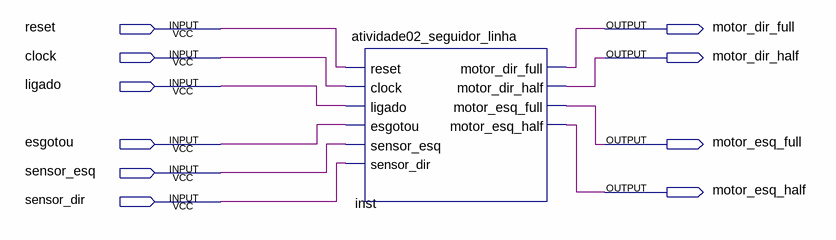
[diagram p0: schematic sheet]
// Quartus schematic Block1.bdf as structural Verilog: 1 symbols, 10 pins
module Block1 (
  input  reset,
  input  clock,
  input  ligado,
  input  esgotou,
  input  sensor_esq,
  input  sensor_dir,
  output motor_dir_full,
  output motor_dir_half,
  output motor_esq_full,
  output motor_esq_half
);

  atividade02_seguidor_linha inst (
    .reset(reset), .clock(clock), .ligado(ligado), .esgotou(esgotou), .sensor_esq(sensor_esq),
    .sensor_dir(sensor_dir), .motor_dir_full(motor_dir_full), .motor_dir_half(motor_dir_half),
    .motor_esq_full(motor_esq_full), .motor_esq_half(motor_esq_half));
endmodule
